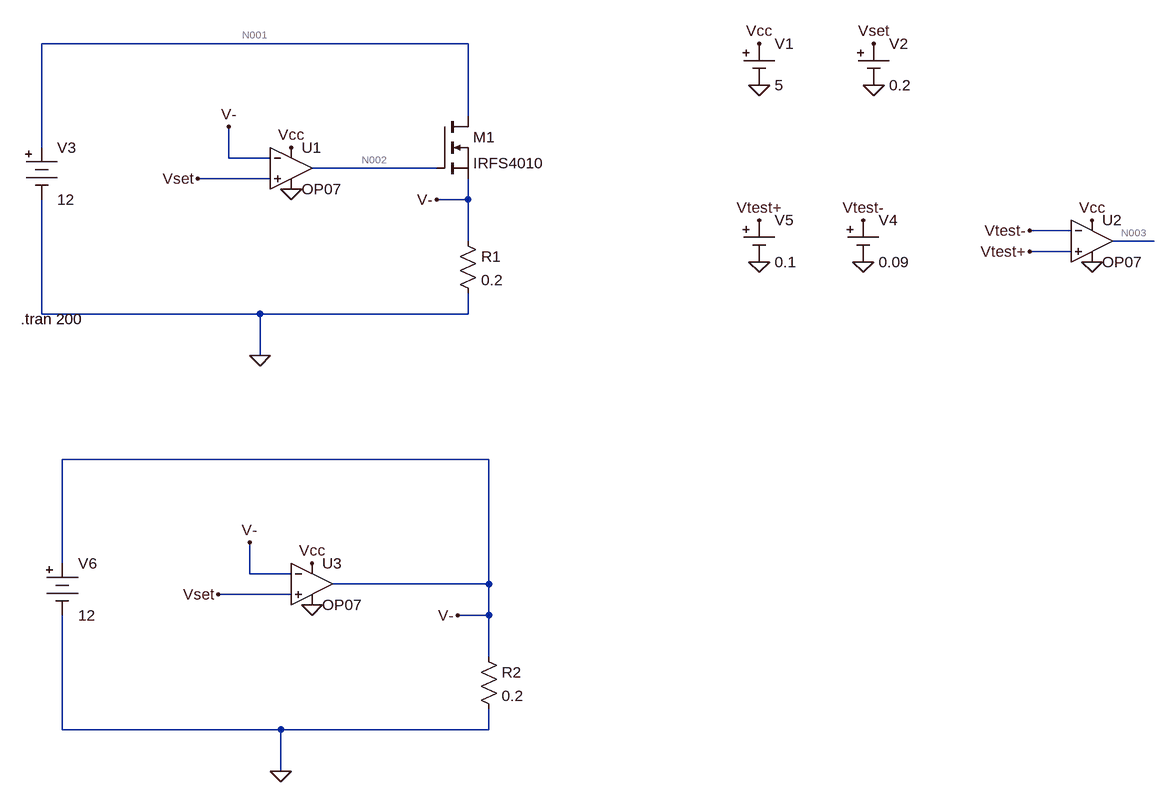
[diagram p0: schematic Draft6.asc]
Draft6.asc, the LTspice schematic file:
Version 4
SHEET 1 1724 1156
WIRE 192 16 -464 16
WIRE 192 128 192 16
WIRE -464 176 -464 16
WIRE -176 192 -176 144
WIRE -112 192 -176 192
WIRE 144 208 -48 208
WIRE -112 224 -224 224
WIRE 192 256 192 224
WIRE 192 256 144 256
WIRE 1120 304 1056 304
WIRE 192 320 192 256
WIRE 1248 320 1184 320
WIRE 1120 336 1056 336
WIRE -464 432 -464 256
WIRE -128 432 -464 432
WIRE 192 432 192 400
WIRE 192 432 -128 432
WIRE -128 496 -128 432
WIRE 224 656 -432 656
WIRE -432 816 -432 656
WIRE -144 832 -144 784
WIRE -80 832 -144 832
WIRE 224 848 224 656
WIRE 224 848 -16 848
WIRE -80 864 -192 864
WIRE 224 896 224 848
WIRE 224 896 176 896
WIRE 224 960 224 896
WIRE -432 1072 -432 896
WIRE -96 1072 -432 1072
WIRE 224 1072 224 1040
WIRE 224 1072 -96 1072
WIRE -96 1136 -96 1072
FLAG 640 16 Vcc
FLAG 640 80 0
FLAG -80 240 0
FLAG -80 176 Vcc
FLAG 816 80 0
FLAG 816 16 Vset
FLAG -224 224 Vset
FLAG 144 256 V-
FLAG -176 144 V-
FLAG -128 496 0
FLAG 1152 288 Vcc
FLAG 1152 352 0
FLAG 1056 336 Vtest+
FLAG 800 352 0
FLAG 800 288 Vtest-
FLAG 640 352 0
FLAG 640 288 Vtest+
FLAG 1056 304 Vtest-
FLAG -48 880 0
FLAG -48 816 Vcc
FLAG -192 864 Vset
FLAG 176 896 V-
FLAG -144 784 V-
FLAG -96 1136 0
SYMBOL nmos 144 128 R0
SYMATTR InstName M1
SYMATTR Value IRFS4010
SYMBOL OpAmps\\OP07 -80 144 R0
SYMATTR InstName U1
SYMBOL Misc\\cell 640 16 R0
WINDOW 123 0 0 Left 0
WINDOW 39 0 0 Left 0
SYMATTR InstName V1
SYMATTR Value 5
SYMBOL Misc\\cell 816 16 R0
WINDOW 123 0 0 Left 0
WINDOW 39 0 0 Left 0
SYMATTR InstName V2
SYMATTR Value 0.2
SYMBOL res 176 304 R0
SYMATTR InstName R1
SYMATTR Value 0.2
SYMBOL Misc\\battery -464 160 R0
WINDOW 123 0 0 Left 0
WINDOW 39 0 0 Left 0
SYMATTR InstName V3
SYMATTR Value 12
SYMBOL OpAmps\\OP07 1152 256 R0
SYMATTR InstName U2
SYMBOL Misc\\cell 800 288 R0
WINDOW 123 0 0 Left 0
WINDOW 39 0 0 Left 0
SYMATTR InstName V4
SYMATTR Value 0.09
SYMBOL Misc\\cell 640 288 R0
WINDOW 123 0 0 Left 0
WINDOW 39 0 0 Left 0
SYMATTR InstName V5
SYMATTR Value 0.1
SYMBOL OpAmps\\OP07 -48 784 R0
SYMATTR InstName U3
SYMBOL res 208 944 R0
SYMATTR InstName R2
SYMATTR Value 0.2
SYMBOL Misc\\battery -432 800 R0
WINDOW 123 0 0 Left 0
WINDOW 39 0 0 Left 0
SYMATTR InstName V6
SYMATTR Value 12
TEXT -496 440 Left 2 !.tran 200

The netlist it stands for:
* Draft6.asc
M1 N001 N002 V- V- IRFS4010
XU1 Vset V- Vcc 0 N002 LT1001  ; OP07, pins In+ In- V+ V- OUT
V1 Vcc 0 5
V2 Vset 0 0.2
R1 V- 0 0.2
V3 N001 0 12
XU2 Vtest+ Vtest- Vcc 0 N003 LT1001  ; OP07, pins In+ In- V+ V- OUT
V4 Vtest- 0 0.09
V5 Vtest+ 0 0.1
XU3 Vset V- Vcc 0 V- LT1001  ; OP07, pins In+ In- V+ V- OUT
R2 V- 0 0.2
V6 V- 0 12
.model NMOS NMOS
.model PMOS PMOS
.lib standard.mos
.tran 200
.lib LTC.lib
.backanno
.end

* Results of the author's LTspice run, read from the files saved beside the schematic
* Operating Point, zero values left out:
*   V(n001) = 12 V
*   V(n002) = 929.5 mV
*   V(v-) = 12 V
*   V(vset) = 200 mV
*   V(vcc) = 5 V
*   V(vtest-) = 90 mV
*   V(vtest+) = 100 mV
*   V(n003) = 4.063 V
*   I(R1) = 60 A
*   I(R2) = 60 A
*   I(V1) = 5.572 TA
*   I(V2) = 17.91 mA
*   I(V4) = 139.3 pA
*   I(V5) = -130.7 pA
*   I(V6) = -5.572 TA
*   Ix(u1:1) = -8.957 mA
*   Ix(u1:2) = 8.957 mA
*   Ix(u1:3) = 2.254 mA
*   Ix(u1:4) = -2.247 mA
*   Ix(u1:5) = 3.141 pA
*   Ix(u2:1) = 130.7 pA
*   Ix(u2:2) = -139.3 pA
*   Ix(u2:3) = 2.25 mA
*   Ix(u2:4) = -2.25 mA
*   Ix(u2:5) = -3.126 pA
*   Ix(u3:1) = -8.957 mA
*   Ix(u3:2) = 8.957 mA
*   Ix(u3:3) = -5.572 TA
*   Ix(u3:4) = -1.681 A
*   Ix(u3:5) = 5.572 TA